# EAGLE schematic damping_resistors (EAGLE 7.5.0)
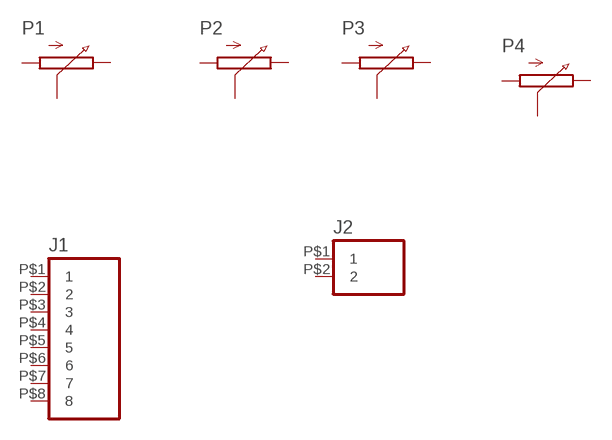
[diagram p0: schematic, sheet 1]

## Parts
J1  8PIN_JONES_PLUG  [8PIN_JONES]
J2  2PIN_JONE_PLUG  [2PIN_JONES]
P1  2WATT_POT  [2W_POT]
P2  2WATT_POT  [2W_POT]
P3  2WATT_POT  [2W_POT]
P4  2WATT_POT  [2W_POT]
Unconnected: J1.P$1 J1.P$2 J1.P$3 J1.P$4 J1.P$5 J1.P$6 J1.P$7 J1.P$8 J2.P$1 J2.P$2 P1.A P1.E P1.S P2.A P2.E P2.S P3.A P3.E P3.S P4.A P4.E P4.S

## Library data of the parts
J1 = keiths:8PIN_JONES_PLUG: 8 pin Jones plug.
J2 = keiths:2PIN_JONE_PLUG: 2 pin Jones plug.
P1-P4 = keiths:2WATT_POT: Panel Mount 2 W pot. RV4NAYSD102A is 1K part number.